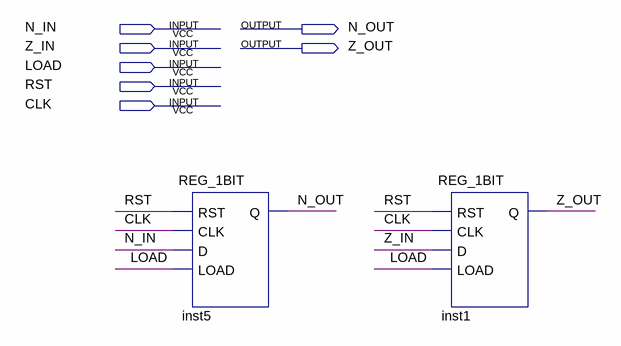
[diagram p0: schematic sheet]
// Quartus schematic NZ.bdf as structural Verilog: 2 symbols, 7 pins
module NZ (
  input  N_IN,
  input  Z_IN,
  input  LOAD,
  input  RST,
  input  CLK,
  output N_OUT,
  output Z_OUT
);

  REG_1BIT inst5 (.RST(RST), .CLK(CLK), .D(N_IN), .LOAD(LOAD), .Q(N_OUT));
  REG_1BIT inst1 (.RST(RST), .CLK(CLK), .D(Z_IN), .LOAD(LOAD), .Q(Z_OUT));
endmodule
